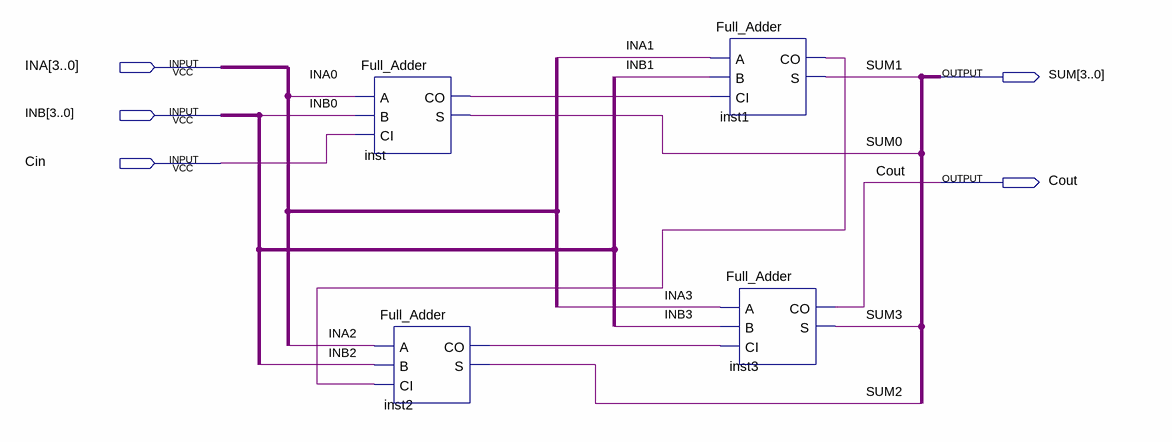
[diagram p0: schematic sheet]
// Quartus schematic Full_Adder_4bit.bdf as structural Verilog: 4 symbols, 5 pins
module Full_Adder_4bit (
  input  [3:0] INA,
  input  [3:0] INB,
  input  Cin,
  output [3:0] SUM,
  output Cout
);

  wire inst1_co, inst2_co, inst_co;

  Full_Adder inst (.A(INA[0]), .B(INB[0]), .CI(Cin), .CO(inst_co), .S(SUM[0]));
  Full_Adder inst2 (.A(INA[2]), .B(INB[2]), .CI(inst1_co), .CO(inst2_co), .S(SUM[2]));
  Full_Adder inst1 (.A(INA[1]), .B(INB[1]), .CI(inst_co), .CO(inst1_co), .S(SUM[1]));
  Full_Adder inst3 (.A(INA[3]), .B(INB[3]), .CI(inst2_co), .CO(Cout), .S(SUM[3]));
endmodule
